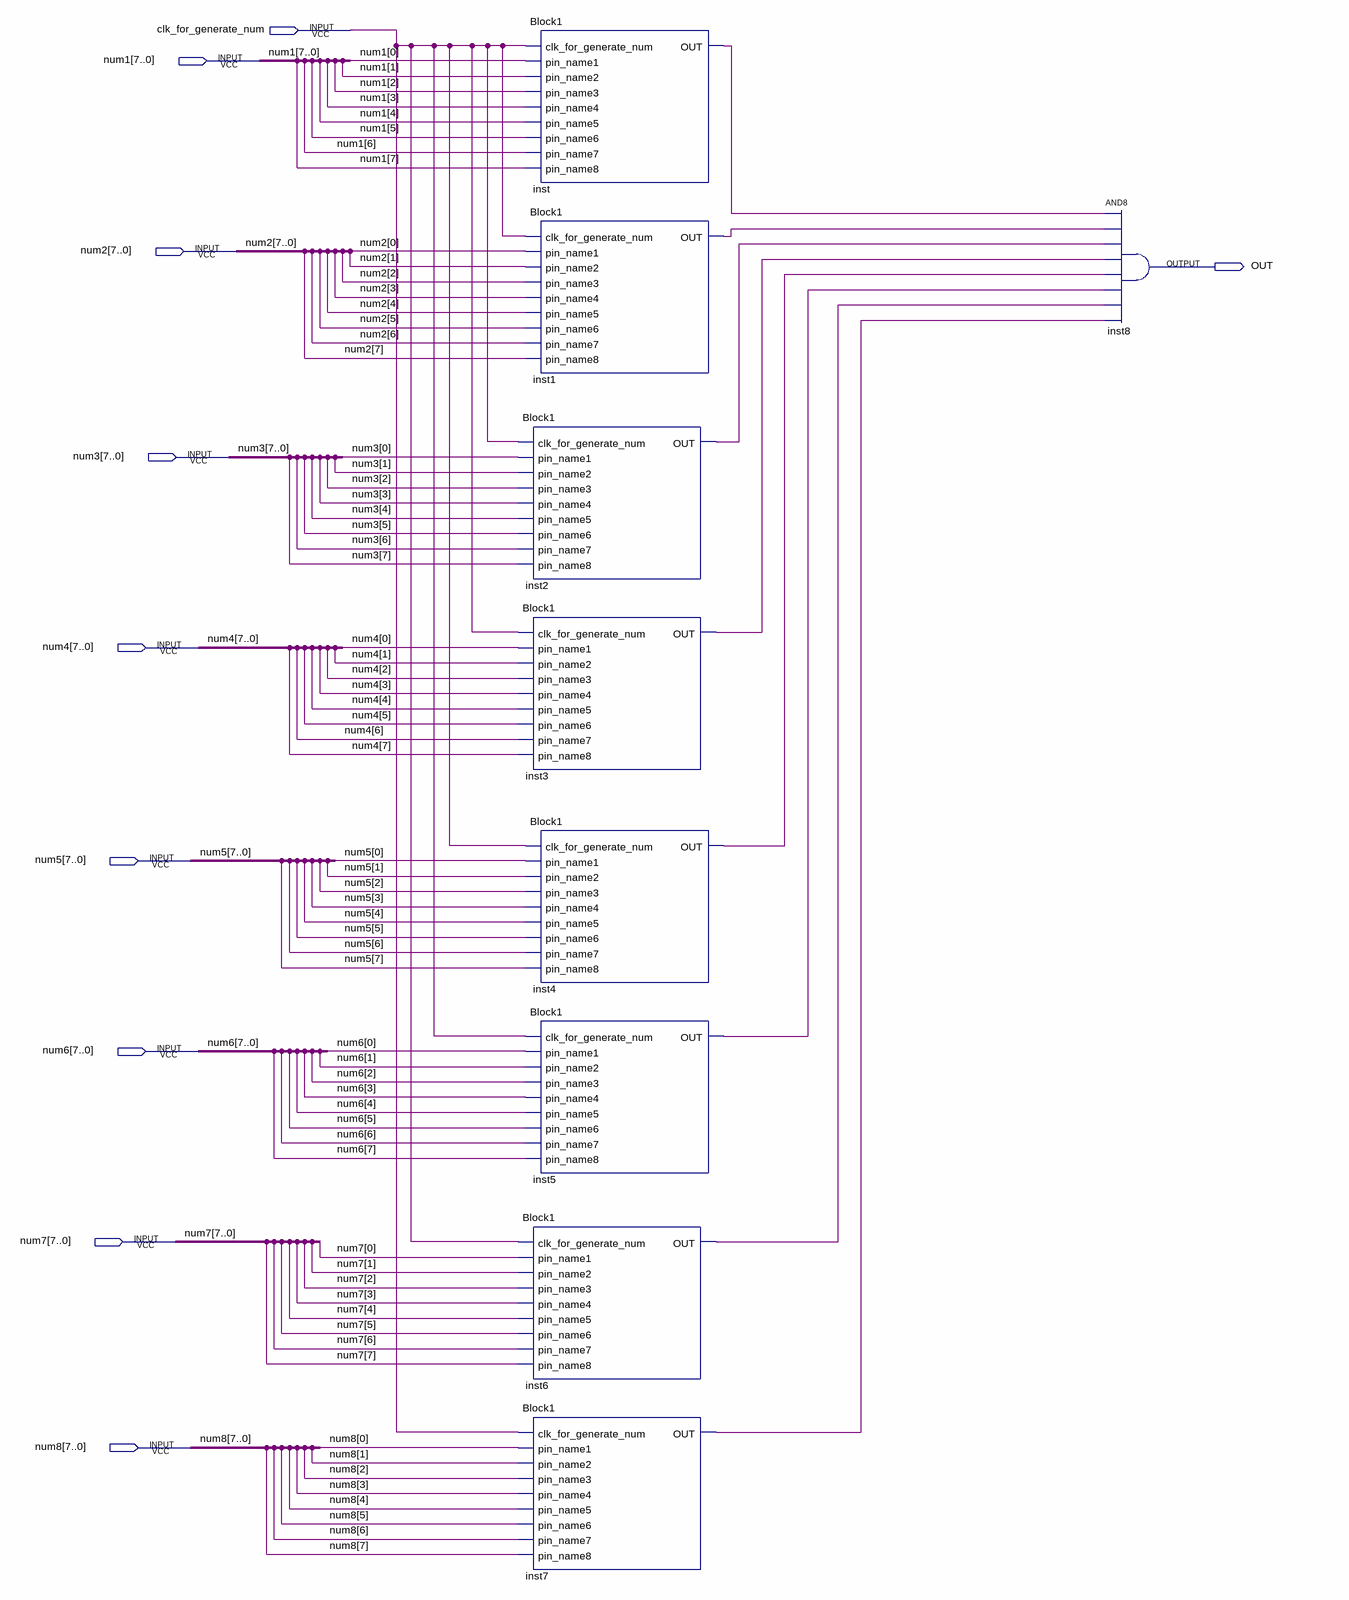
[diagram p0: schematic sheet]
// Quartus schematic bus_compare_to_register.bdf as structural Verilog: 9 symbols, 10 pins
module bus_compare_to_register (
  input  clk_for_generate_num,
  input  [7:0] num1,
  input  [7:0] num2,
  input  [7:0] num3,
  input  [7:0] num4,
  input  [7:0] num5,
  input  [7:0] num6,
  input  [7:0] num7,
  input  [7:0] num8,
  output OUT
);

  wire inst1_out, inst2_out, inst3_out, inst4_out, inst5_out, inst6_out, inst7_out, inst_out;

  Block1 inst (
    .clk_for_generate_num(clk_for_generate_num), .pin_name1(num1[0]), .pin_name2(num1[1]),
    .pin_name3(num1[2]), .pin_name4(num1[3]), .pin_name5(num1[4]), .pin_name6(num1[5]), .pin_name7(num1[6]),
    .pin_name8(num1[7]), .OUT(inst_out));
  Block1 inst1 (
    .clk_for_generate_num(clk_for_generate_num), .pin_name1(num2[0]), .pin_name2(num2[1]),
    .pin_name3(num2[2]), .pin_name4(num2[3]), .pin_name5(num2[4]), .pin_name6(num2[5]), .pin_name7(num2[6]),
    .pin_name8(num2[7]), .OUT(inst1_out));
  Block1 inst2 (
    .clk_for_generate_num(clk_for_generate_num), .pin_name1(num3[0]), .pin_name2(num3[1]),
    .pin_name3(num3[2]), .pin_name4(num3[3]), .pin_name5(num3[4]), .pin_name6(num3[5]), .pin_name7(num3[6]),
    .pin_name8(num3[7]), .OUT(inst2_out));
  Block1 inst3 (
    .clk_for_generate_num(clk_for_generate_num), .pin_name1(num4[0]), .pin_name2(num4[1]),
    .pin_name3(num4[2]), .pin_name4(num4[3]), .pin_name5(num4[4]), .pin_name6(num4[5]), .pin_name7(num4[6]),
    .pin_name8(num4[7]), .OUT(inst3_out));
  Block1 inst4 (
    .clk_for_generate_num(clk_for_generate_num), .pin_name1(num5[0]), .pin_name2(num5[1]),
    .pin_name3(num5[2]), .pin_name4(num5[3]), .pin_name5(num5[4]), .pin_name6(num5[5]), .pin_name7(num5[6]),
    .pin_name8(num5[7]), .OUT(inst4_out));
  Block1 inst5 (
    .clk_for_generate_num(clk_for_generate_num), .pin_name1(num6[0]), .pin_name2(num6[1]),
    .pin_name3(num6[2]), .pin_name4(num6[3]), .pin_name5(num6[4]), .pin_name6(num6[5]), .pin_name7(num6[6]),
    .pin_name8(num6[7]), .OUT(inst5_out));
  Block1 inst6 (
    .clk_for_generate_num(clk_for_generate_num), .pin_name1(num7[0]), .pin_name2(num7[1]),
    .pin_name3(num7[2]), .pin_name4(num7[3]), .pin_name5(num7[4]), .pin_name6(num7[5]), .pin_name7(num7[6]),
    .pin_name8(num7[7]), .OUT(inst6_out));
  Block1 inst7 (
    .clk_for_generate_num(clk_for_generate_num), .pin_name1(num8[0]), .pin_name2(num8[1]),
    .pin_name3(num8[2]), .pin_name4(num8[3]), .pin_name5(num8[4]), .pin_name6(num8[5]), .pin_name7(num8[6]),
    .pin_name8(num8[7]), .OUT(inst7_out));
  and inst8 (OUT, inst_out, inst1_out, inst2_out, inst3_out, inst4_out, inst5_out, inst6_out, inst7_out);
endmodule
